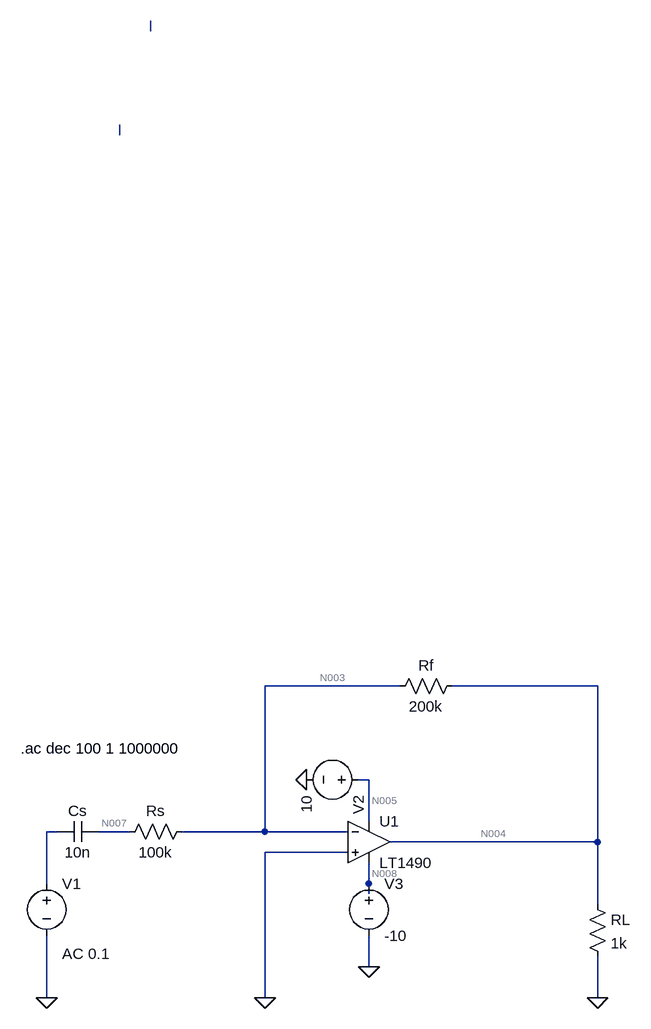
[diagram p0: schematic 15 onward.asc]
15 onward.asc, the LTspice schematic file:
Version 4
SHEET 1 980 680
WIRE 208 -1248 208 -1264
WIRE 160 -1088 160 -1104
WIRE 592 -240 384 -240
WIRE 896 -240 672 -240
WIRE 544 -96 528 -96
WIRE 544 -32 544 -96
WIRE 64 -16 48 -16
WIRE 176 -16 128 -16
WIRE 384 -16 384 -240
WIRE 384 -16 256 -16
WIRE 512 -16 384 -16
WIRE 896 0 896 -240
WIRE 896 0 576 0
WIRE 512 16 384 16
WIRE 48 64 48 -16
WIRE 544 64 544 32
WIRE 544 80 544 64
WIRE 896 96 896 0
WIRE 544 192 544 144
WIRE 48 240 48 144
WIRE 384 240 384 16
WIRE 896 240 896 176
FLAG 896 240 0
FLAG 384 240 0
FLAG 48 240 0
FLAG 544 192 0
FLAG 448 -96 0
SYMBOL voltage 48 48 R0
WINDOW 123 24 124 Left 2
WINDOW 39 0 0 Left 0
SYMATTR Value2 AC 0.1
SYMATTR InstName V1
SYMATTR Value ""
SYMBOL res 272 -32 R90
WINDOW 0 0 56 VBottom 2
WINDOW 3 32 56 VTop 2
SYMATTR InstName Rs
SYMATTR Value 100k
SYMBOL res 688 -256 R90
WINDOW 0 0 56 VBottom 2
WINDOW 3 32 56 VTop 2
SYMATTR InstName Rf
SYMATTR Value 200k
SYMBOL OpAmps\\LT1490 544 -64 R0
SYMATTR InstName U1
SYMBOL res 880 80 R0
SYMATTR InstName RL
SYMATTR Value 1k
SYMBOL voltage 544 -96 R90
WINDOW 123 0 0 Left 0
WINDOW 39 0 0 Left 0
SYMATTR InstName V2
SYMATTR Value 10
SYMBOL voltage 544 48 R0
WINDOW 123 0 0 Left 0
WINDOW 39 0 0 Left 0
SYMATTR InstName V3
SYMATTR Value -10
SYMBOL cap 128 -32 R90
WINDOW 0 0 32 VBottom 2
WINDOW 3 32 32 VTop 2
SYMATTR InstName Cs
SYMATTR Value 10n
TEXT 8 -144 Left 2 !.ac dec 100 1 1000000

The netlist it stands for:
* 15 onward.asc
V1 N006 0 AC 0.1
Rs N003 N007 100k
Rf N004 N003 200k
XU1 0 N003 N005 N008 N004 LT1490  ; pins In+ In- V+ V- OUT
RL N004 0 1k
V2 N005 0 10
V3 N008 0 -10
Cs N007 N006 10n
.ac dec 100 1 1000000
.backanno
.end

* Results of the author's LTspice run, read from the files saved beside the schematic
* Operating Point, zero values left out:
*   V(n003) = 255.9 nV
*   V(n007) = 255.9 nV
*   V(n004) = -220.3 µV
*   V(n005) = 10 V
*   V(n008) = -10 V
*   I(Rl) = -220.3 nA
*   I(Rf) = -1.103 nA
*   I(V3) = 43.02 µA
*   I(V2) = -42.8 µA
*   Ix(u1:1) = -1.103 nA
*   Ix(u1:2) = -1.103 nA
*   Ix(u1:3) = 42.8 µA
*   Ix(u1:4) = -43.02 µA
*   Ix(u1:5) = 221.4 nA
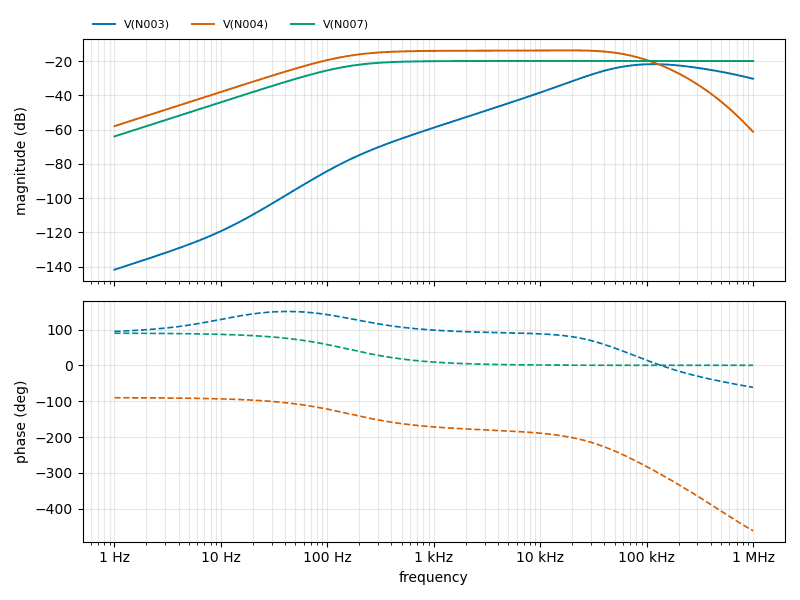
[diagram p1: AC Analysis of 15 onward.asc, plotted from the saved traces]
* AC Analysis, 1 run:
*   V(N003): -141.84 dB at 1 Hz, -30.37 dB at 1 MHz, peak -21.83 dB at 117.5 kHz, 3 dB below the peak at 45.13 kHz and 369.5 kHz
*   V(N004): -58.02 dB at 1 Hz, -61.34 dB at 1 MHz, peak -13.80 dB at 18.62 kHz, 3 dB below the peak at 165.6 Hz and 70.45 kHz
*   V(N007): -64.04 dB at 1 Hz, -20.00 dB at 1 MHz, peak -19.98 dB at 23.44 kHz, 3 dB below the peak at 159.5 Hz